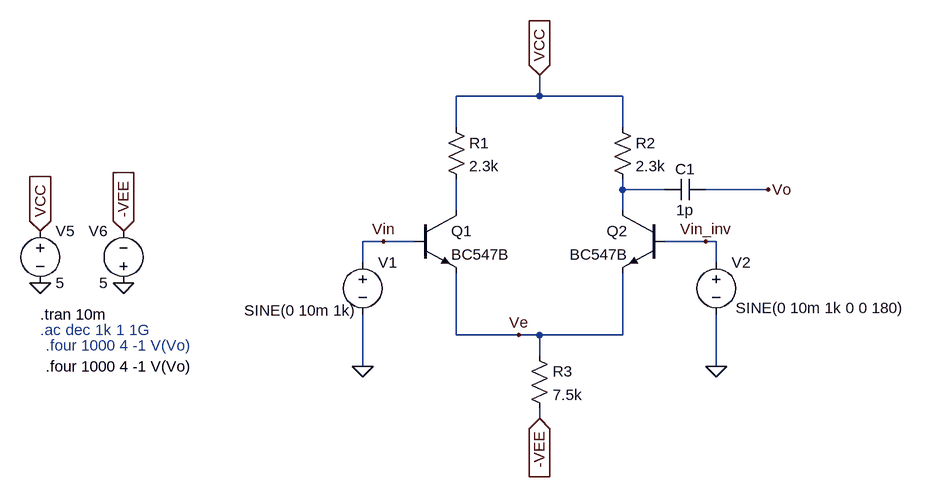
[diagram p0: schematic Preamp_Final.asc]
Preamp_Final.asc, the LTspice schematic file:
Version 4
SHEET 1 880 680
WIRE -192 -48 -192 -80
WIRE -192 -48 -320 -48
WIRE -64 -48 -192 -48
WIRE -320 0 -320 -48
WIRE -64 0 -64 -48
WIRE -64 96 -64 80
WIRE 0 96 -64 96
WIRE 160 96 64 96
WIRE -320 128 -320 80
WIRE -64 128 -64 96
WIRE -432 176 -464 176
WIRE -384 176 -432 176
WIRE 64 176 0 176
WIRE 80 176 64 176
WIRE -464 208 -464 176
WIRE 80 208 80 176
WIRE -320 320 -320 224
WIRE -224 320 -320 320
WIRE -192 320 -224 320
WIRE -64 320 -64 224
WIRE -64 320 -192 320
WIRE -192 352 -192 320
WIRE -464 368 -464 288
WIRE 80 368 80 288
WIRE -192 448 -192 432
FLAG -464 368 0
FLAG 80 368 0
FLAG -432 176 Vin
FLAG 64 176 Vin_inv
FLAG -224 320 Ve
FLAG -832 240 0
FLAG -960 240 0
FLAG -960 160 VCC
IOPIN -960 160 In
FLAG -832 160 -VEE
IOPIN -832 160 In
FLAG -192 448 -VEE
IOPIN -192 448 In
FLAG -192 -80 VCC
IOPIN -192 -80 In
FLAG 160 96 Vo
SYMBOL res -336 -16 R0
SYMATTR InstName R1
SYMATTR Value 2.3k
SYMBOL res -80 -16 R0
SYMATTR InstName R2
SYMATTR Value 2.3k
SYMBOL npn -384 128 R0
SYMATTR InstName Q1
SYMATTR Value BC547B
SYMBOL npn 0 128 M0
SYMATTR InstName Q2
SYMATTR Value BC547B
SYMBOL res -208 336 R0
SYMATTR InstName R3
SYMATTR Value 7.5k
SYMBOL voltage -960 144 R0
SYMATTR InstName V5
SYMATTR Value 5
SYMBOL voltage -832 256 R180
WINDOW 0 24 96 Left 2
WINDOW 3 24 16 Left 2
SYMATTR InstName V6
SYMATTR Value 5
SYMBOL cap 64 80 R90
WINDOW 0 0 32 VBottom 2
WINDOW 3 32 32 VTop 2
SYMATTR InstName C1
SYMATTR Value 1p
SYMBOL voltage -464 192 R0
WINDOW 123 -182 114 Left 2
WINDOW 39 0 0 Left 0
WINDOW 3 -182 90 Left 2
SYMATTR Value SINE(0 10m 1k)
SYMATTR InstName V1
SYMBOL voltage 80 192 R0
WINDOW 123 30 110 Left 2
WINDOW 39 0 0 Left 0
WINDOW 3 30 86 Left 2
SYMATTR Value SINE(0 10m 1k 0 0 180)
SYMATTR InstName V2
TEXT -960 288 Left 2 !.tran 10m
TEXT -960 312 Left 2 ;.ac dec 1k 1 1G
TEXT -952 336 Left 2 ;.four 1000 4 -1 V(Vo)
TEXT -952 368 Left 2 !.four 1000 4 -1 V(Vo)

The netlist it stands for:
* Preamp_Final.asc
R1 VCC N002 2.3k
R2 VCC N001 2.3k
Q1 N002 Vin Ve 0 BC547B
Q2 N001 Vin_inv Ve 0 BC547B
R3 Ve -VEE 7.5k
V5 VCC 0 5
V6 0 -VEE 5
C1 Vo N001 1p
V1 Vin 0 SINE(0 10m 1k)
V2 Vin_inv 0 SINE(0 10m 1k 0 0 180)
.model NPN NPN
.model PNP PNP
.lib standard.bjt
.tran 10m
* .ac dec 1k 1 1G
* .four 1000 4 -1 V(Vo)
.four 1000 4 -1 V(Vo)
.backanno
.end